# EAGLE design adc_cap (EAGLE 7.1.0)
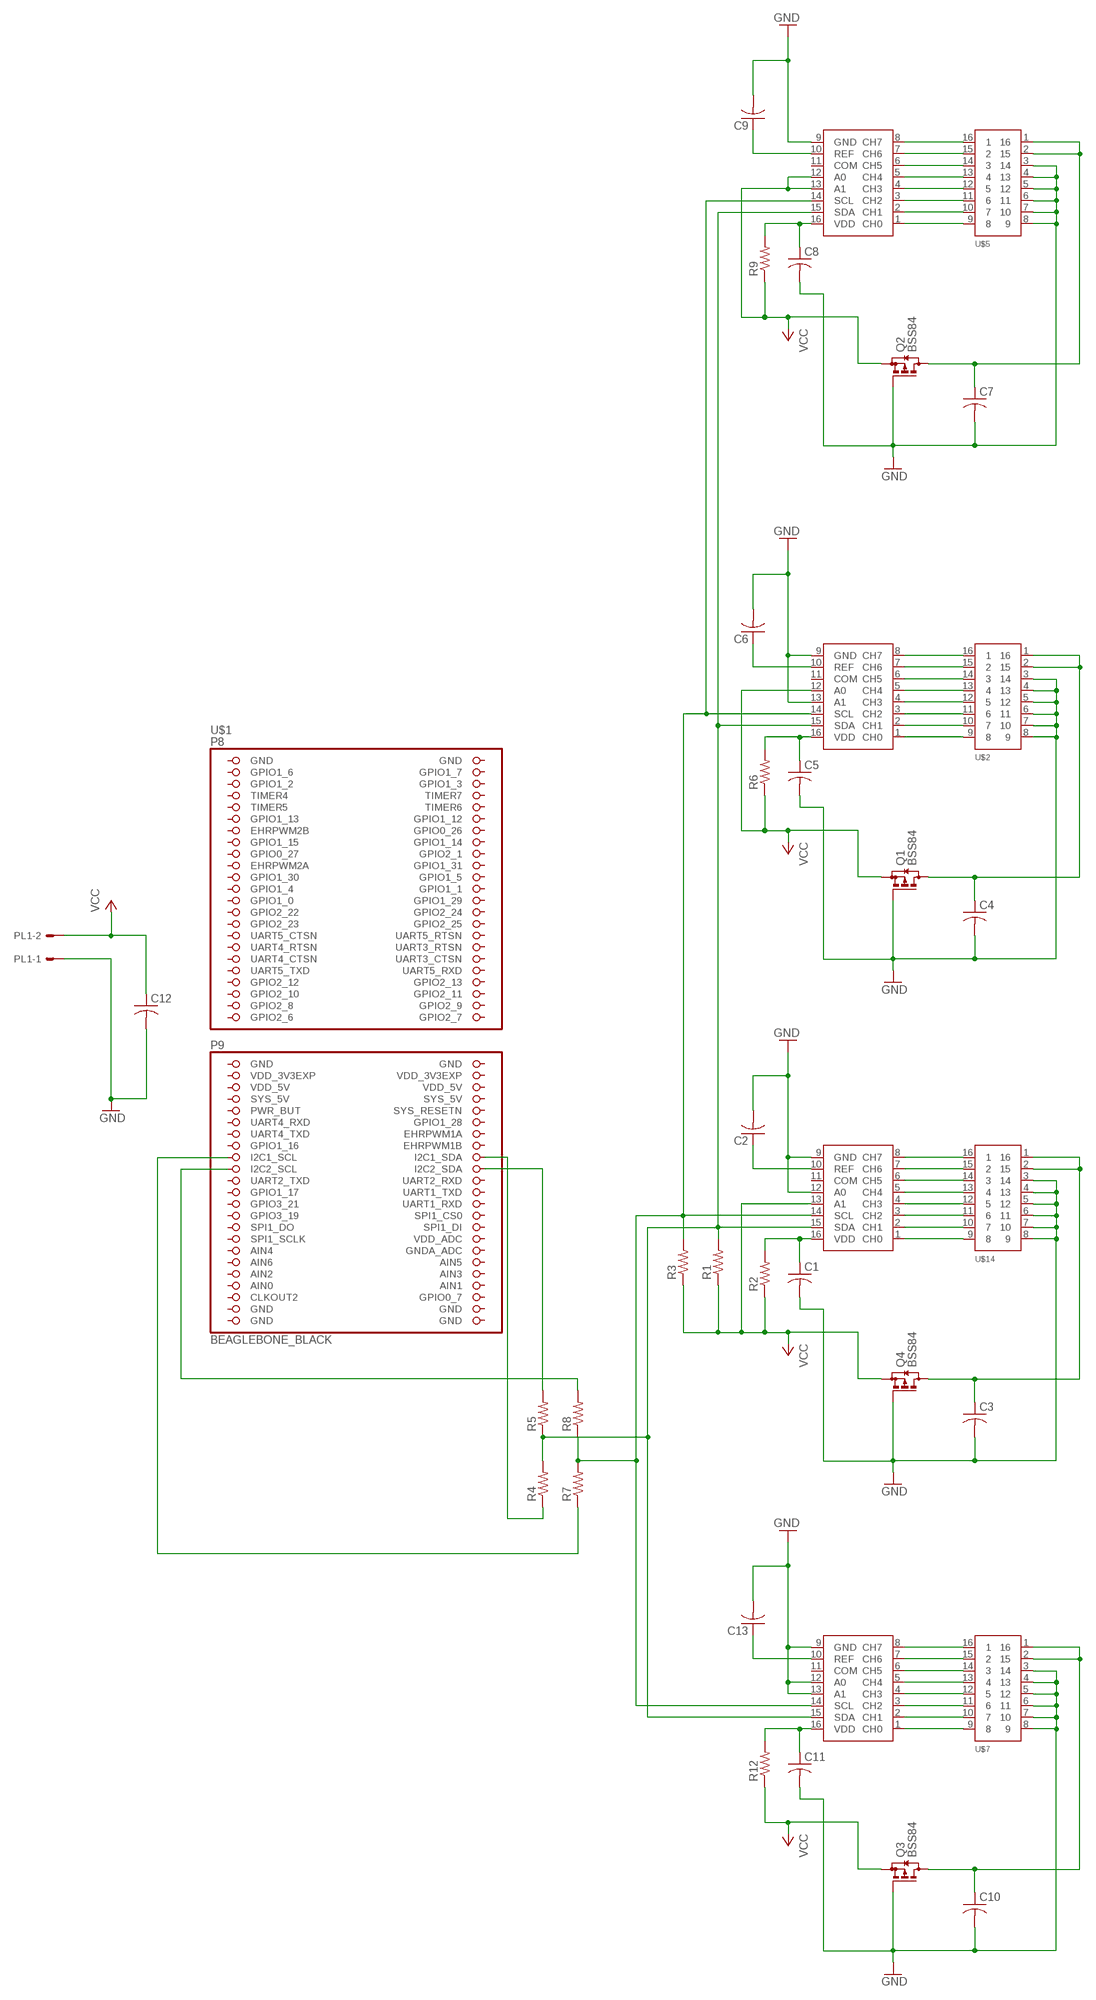
[diagram p0: schematic, sheet 1]

## Parts
C1  C-USC0805  [C0805]
C2  C-USC0805  [C0805]
C3  C-USC0805  [C0805]
C4  C-USC0805  [C0805]
C5  C-USC0805  [C0805]
C6  C-USC0805  [C0805]
C7  C-USC0805  [C0805]
C8  C-USC0805  [C0805]
C9  C-USC0805  [C0805]
C10  C-USC0805  [C0805]
C11  C-USC0805  [C0805]
C12  C-USC0805  [C0805]
C13  C-USC0805  [C0805]
PL1  555X-2H  [5569-2]
Q1  BSS84  [SOT23]
Q2  BSS84  [SOT23]
Q3  BSS84  [SOT23]
Q4  BSS84  [SOT23]
R1  R-US_R0805  [R0805]
R2  R-US_R0805  [R0805]
R3  R-US_R0805  [R0805]
R4  R-US_R0805  [R0805]
R5  R-US_R0805  [R0805]
R6  R-US_R0805  [R0805]
R7  R-US_R0805  [R0805]
R8  R-US_R0805  [R0805]
R9  R-US_R0805  [R0805]
R12  R-US_R0805  [R0805]
U$1  BEAGLEBONE_BLACK  [BEAGEBONE]
U$2  2_X_8_CON  [2_X_8_PIN]
U$3  ADS7830  [ADC8_SD]
U$4  ADS7830  [ADC8_SD]
U$5  2_X_8_CON  [2_X_8_PIN]
U$6  ADS7830  [ADC8_SD]
U$7  2_X_8_CON  [2_X_8_PIN]
U$8  ADS7830  [ADC8_SD]
U$14  2_X_8_CON  [2_X_8_PIN]

## Nets
GND: C1.2 C2.2 C3.2 C4.2 C5.2 C6.2 C7.2 C8.2 C9.2 C10.2 C11.2 C12.2 C13.2 PL1.1 Q1.1(G) Q2.1(G) Q3.1(G) Q4.1(G) U$2.3 U$2.4 U$2.5 U$2.6 U$2.7 U$2.8 U$3.9(GND) U$3.12(A0) U$4.9(GND) U$4.13(A1) U$5.3 U$5.4 U$5.5 U$5.6 U$5.7 U$5.8 U$6.9(GND) U$7.3 U$7.4 U$7.5 U$7.6 U$7.7 U$7.8 U$8.9(GND) U$8.12(A0) U$8.13(A1) U$14.3 U$14.4 U$14.5 U$14.6 U$14.7 U$14.8
N$1: U$3.1(CH0) U$14.9
N$2: R1.2 R4.2 R5.1 U$3.15(SDA) U$4.15(SDA) U$6.15(SDA) U$8.15(SDA)
N$3: U$3.2(CH1) U$14.10
N$4: U$3.3(CH2) U$14.11
N$5: U$3.4(CH3) U$14.12
N$6: U$3.5(CH4) U$14.13
N$7: U$3.6(CH5) U$14.14
N$8: U$3.7(CH6) U$14.15
N$9: U$3.8(CH7) U$14.16
N$10: R5.2 U$1.167(I2C2_SDA)
N$11: C1.1 R2.2 U$3.16(VDD)
N$12: C2.1 U$3.10(REF)
N$13: R3.2 R7.2 R8.1 U$3.14(SCL) U$4.14(SCL) U$6.14(SCL) U$8.14(SCL)
N$14: C4.1 Q1.3(D) U$2.1 U$2.2
N$15: U$2.9 U$4.1(CH0)
N$16: U$2.10 U$4.2(CH1)
N$17: U$2.11 U$4.3(CH2)
N$18: U$2.12 U$4.4(CH3)
N$19: U$2.13 U$4.5(CH4)
N$20: U$2.14 U$4.6(CH5)
N$21: U$2.15 U$4.7(CH6)
N$22: U$2.16 U$4.8(CH7)
N$23: R4.1 U$1.165(I2C1_SDA)
N$24: R8.2 U$1.166(I2C2_SCL)
N$25: C5.1 R6.2 U$4.16(VDD)
N$26: C6.1 U$4.10(REF)
N$27: C7.1 Q2.3(D) U$5.1 U$5.2
N$28: U$5.9 U$6.1(CH0)
N$29: U$5.10 U$6.2(CH1)
N$30: U$5.11 U$6.3(CH2)
N$31: U$5.12 U$6.4(CH3)
N$32: U$5.13 U$6.5(CH4)
N$33: U$5.14 U$6.6(CH5)
N$34: U$5.15 U$6.7(CH6)
N$35: U$5.16 U$6.8(CH7)
N$36: R7.1 U$1.168(I2C1_SCL)
N$38: C8.1 R9.2 U$6.16(VDD)
N$39: C9.1 U$6.10(REF)
N$40: C10.1 Q3.3(D) U$7.1 U$7.2
N$41: U$7.9 U$8.1(CH0)
N$42: U$7.10 U$8.2(CH1)
N$43: U$7.11 U$8.3(CH2)
N$44: U$7.12 U$8.4(CH3)
N$45: U$7.13 U$8.5(CH4)
N$46: U$7.14 U$8.6(CH5)
N$47: U$7.15 U$8.7(CH6)
N$48: U$7.16 U$8.8(CH7)
N$51: C11.1 R12.2 U$8.16(VDD)
N$52: C13.1 U$8.10(REF)
N$76: C3.1 Q4.3(D) U$14.1 U$14.2
VCC: C12.1 PL1.2 Q1.2(S) Q2.2(S) Q3.2(S) Q4.2(S) R1.1 R2.1 R3.1 R6.1 R9.1 R12.1 U$3.13(A1) U$4.12(A0) U$6.12(A0) U$6.13(A1)
Unconnected: U$1.93(GPIO2_7) U$1.94(GPIO2_6) U$1.95(GPIO2_9) U$1.96(GPIO2_8) U$1.97(GPIO2_11) U$1.98(GPIO2_10) U$1.99(GPIO2_13) U$1.100(GPIO2_12) U$1.101(UART5_RXD) U$1.102(UART5_TXD) U$1.103(UART3_CTSN) U$1.104(UART4_CTSN) U$1.105(UART3_RTSN) U$1.106(UART4_RTSN) U$1.107(UART5_RTSN) U$1.108(UART5_CTSN) U$1.109(GPIO2_25) U$1.110(GPIO2_23) U$1.111(GPIO2_24) U$1.112(GPIO2_22) U$1.113(GPIO1_29) U$1.114(GPIO1_0) U$1.115(GPIO1_1) U$1.116(GPIO1_4) U$1.117(GPIO1_5) U$1.118(GPIO1_30) U$1.119(GPIO1_31) U$1.120(EHRPWM2A) U$1.121(GPIO2_1) U$1.122(GPIO0_27) U$1.123(GPIO1_14) U$1.124(GPIO1_15) U$1.125(GPIO0_26) U$1.126(EHRPWM2B) U$1.127(GPIO1_12) U$1.128(GPIO1_13) U$1.129(TIMER6) U$1.130(TIMER5) U$1.131(TIMER7) U$1.132(TIMER4) U$1.133(GPIO1_3) U$1.134(GPIO1_2) U$1.135(GPIO1_7) U$1.136(GPIO1_6) U$1.143(GPIO0_7) U$1.144(CLKOUT2) U$1.145(AIN1) U$1.147(AIN3) U$1.148(AIN2) U$1.149(AIN5) U$1.150(AIN6) U$1.151(GNDA_ADC) U$1.152(AIN4) U$1.153(VDD_ADC) U$1.154(SPI1_SCLK) U$1.155(SPI1_DI) U$1.156(SPI1_DO) U$1.157(SPI1_CS0) U$1.158(GPIO3_19) U$1.159(UART1_RXD) U$1.160(GPIO3_21) U$1.161(UART1_TXD) U$1.162(GPIO1_17) U$1.163(UART2_RXD) U$1.164(UART2_TXD) U$1.169(EHRPWM1B) U$1.170(GPIO1_16) U$1.171(EHRPWM1A) U$1.172(UART4_TXD) U$1.173(GPIO1_28) U$1.174(UART4_RXD) U$1.175(SYS_RESETN) U$1.176(PWR_BUT) U$1.177(SYS_5V) U$3.11(COM) U$4.11(COM) U$6.11(COM) U$8.11(COM)

## Power pins joined to a net without a drawn wire
AIN0: U$1.146(AIN0)
GND: U$1.137(GND) U$1.138(GND) U$1.139(GND) U$1.140(GND) U$1.141(GND) U$1.142(GND) U$1.183(GND) U$1.184(GND)
SYS_5V: U$1.178(SYS_5V)
VDD_3V3EXP: U$1.181(VDD_3V3EXP) U$1.182(VDD_3V3EXP)
VDD_5V: U$1.179(VDD_5V) U$1.180(VDD_5V)

## Library data of the parts
C1-C13 = rcl:C-US: CAPACITOR, American symbol
PL1 = con-molex-2:555X-2: Mini FIT connector 2 way
Q1-Q4 = transistor-small-signal:BSS84: P-CHANNEL MOS FET
R1-R9 R12 = adafruit:R-US_: RESISTOR, American symbol
U$1 = BeagleBone:BEAGLEBONE_BLACK
U$2 U$5 U$7 U$14 = 11_pin_connecterp:2_X_8_CON
U$3 U$4 U$6 U$8 = ADC128D818:ADS7830

## Net classes
0 default: width 0.203 mm, drill 0.381 mm, clearance 0.254 mm

## Board
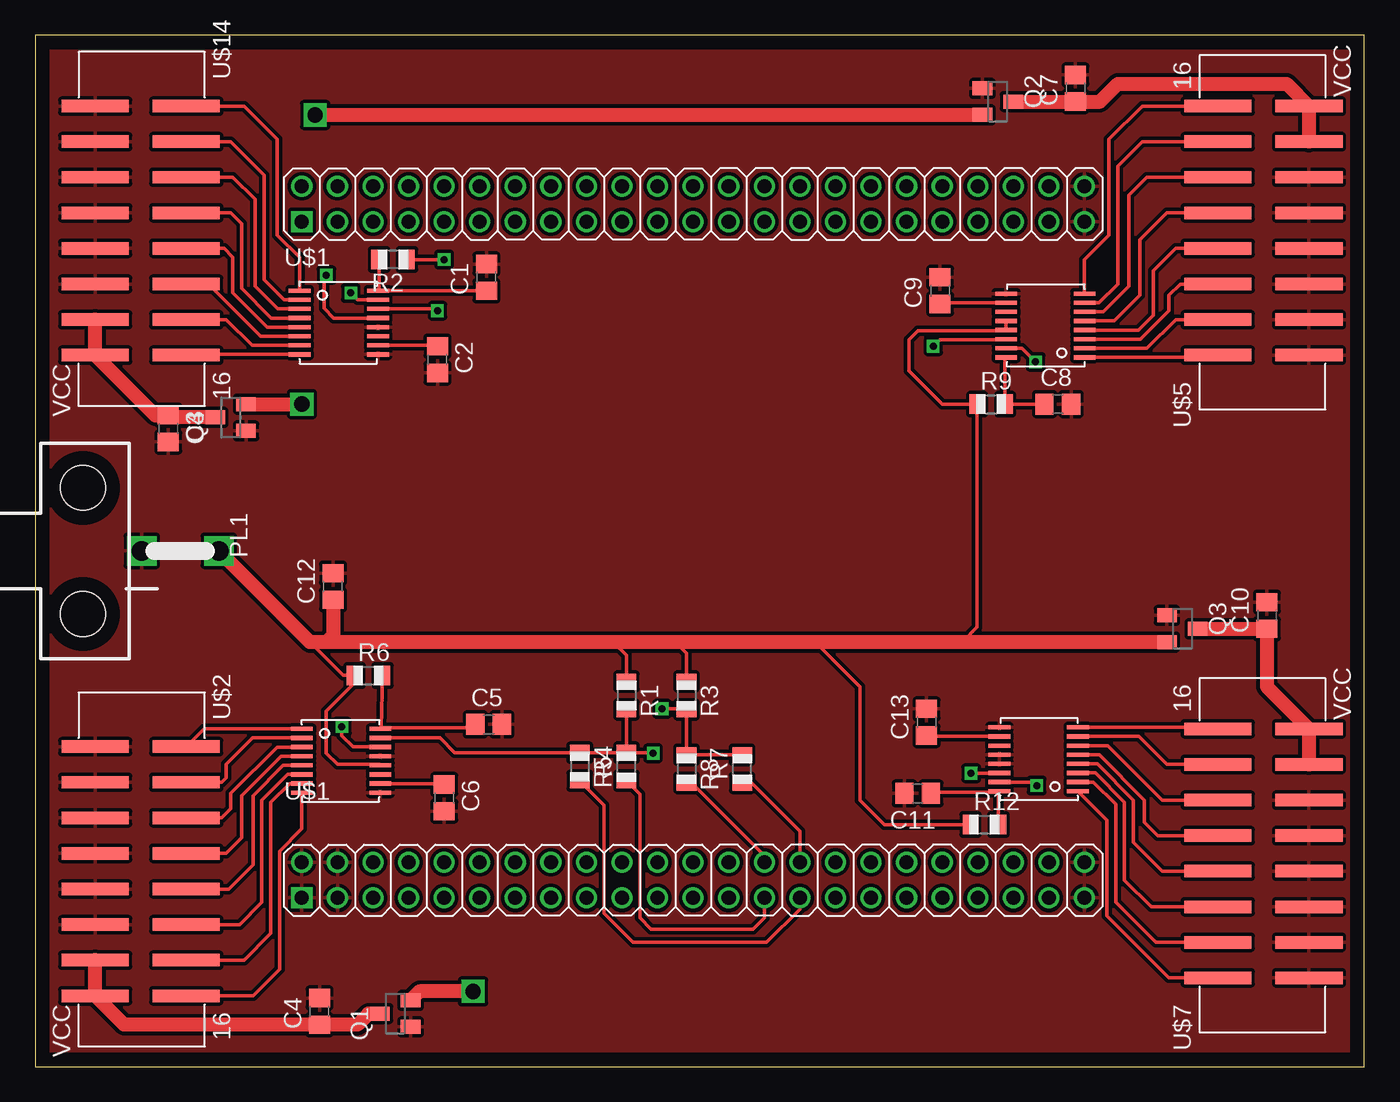
[diagram p1: board, top side]
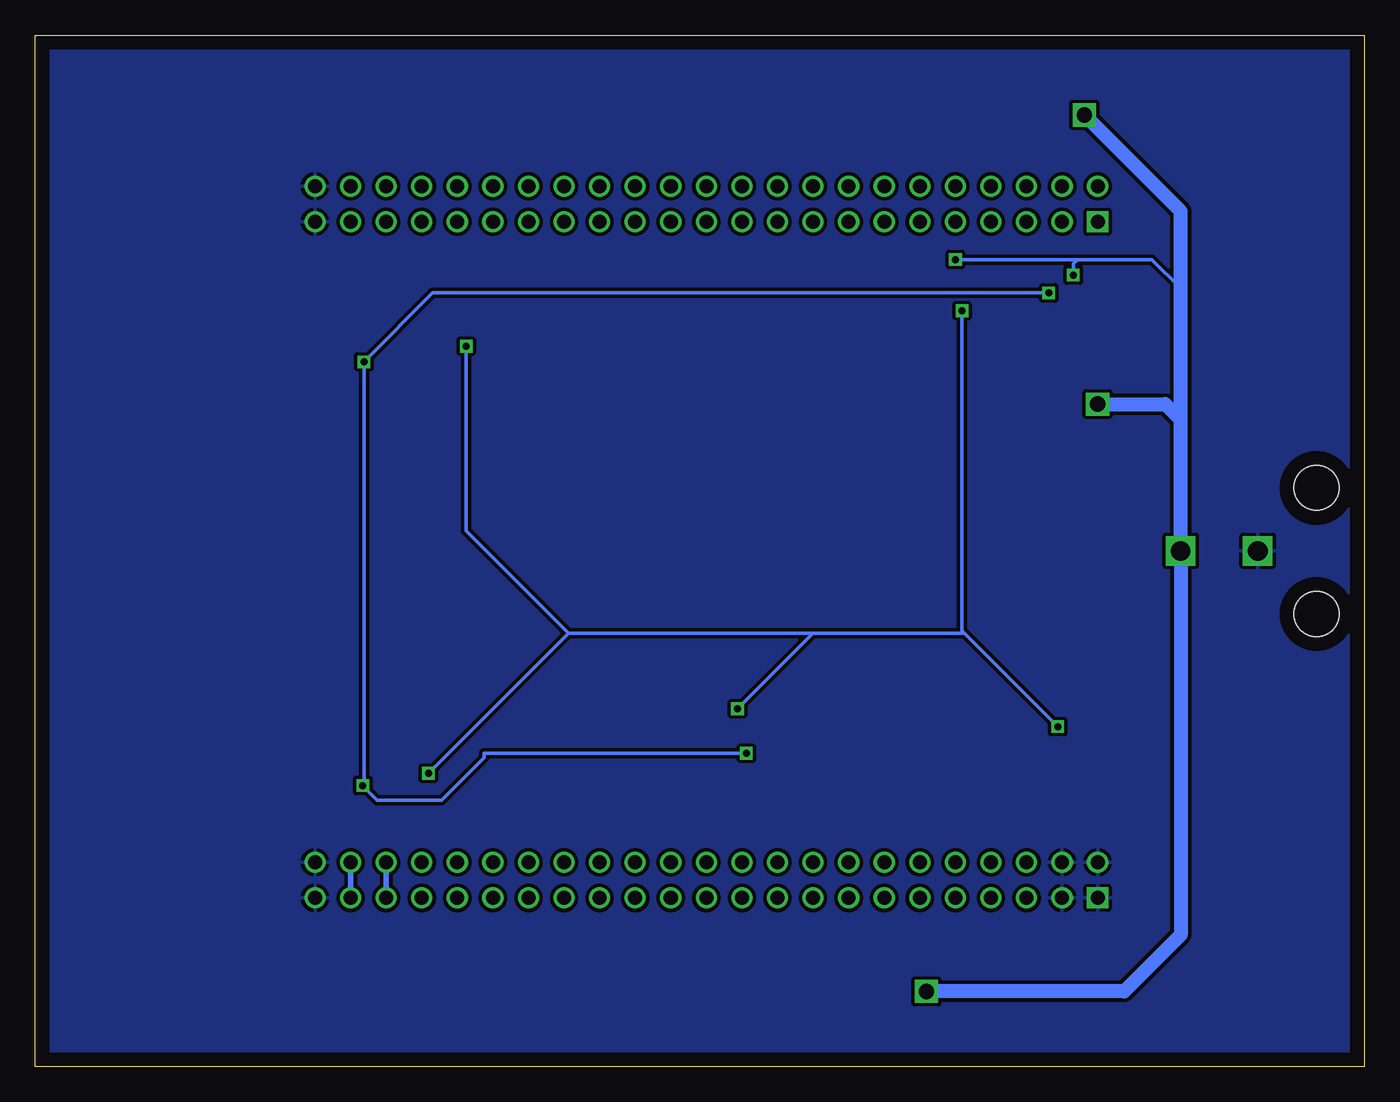
[diagram p2: board, bottom side, seen from below]

Size 94.92 x 73.65 mm. Coordinates in mm from the lower left corner, seen from the top.
Outline: 0,0 94.92,0 94.92,73.65 0,73.65 0,0
Copper layers (1*16): Top 0.035mm / dielectric 1.5mm / Bottom 0.035mm
Design rules "default": minimum track width 10mil, minimum drill 24mil, track to track 8mil, track to pad 8mil, pad to pad 8mil, via to via 8mil, smd to smd 8mil, copper to edge 40mil, drill to drill 8mil, minimum pad ring 10mil, minimum via ring 8mil, stop-mask expansion 4mil, vias tented up to drill 0mil, thermal gap 10mil

### Footprints (pad centres in the part's own frame; a part is rotated, then mirrored left to right if it is on the bottom)
C0805 = smd 1.3 x 1.5: 1 -0.95,0; 2 0.95,0
5569-2 = drill 1.4 square: 1 0,0; 2 0,5.5 | hole 3.2: 4.5,-4.2; -4.5,-4.2
SOT23 = smd 1 x 1.4: 1 -0.95,-1.1; 2 0.95,-1.1; 3 0,1.1
R0805 = smd 1.1 x 1.4: 1 -1,0; 2 1,0
BEAGEBONE = drill 1 square: 93 -22.225,-33.02; 139 26.035,-33.02 | drill 1: 94 -24.765,-33.02; 95 -22.225,-30.48; 96 -24.765,-30.48; 97 -22.225,-27.94; 98 -24.765,-27.94; 99 -22.225,-25.4; 100 -24.765,-25.4; 101 -22.225,-22.86; 102 -24.765,-22.86; 103 -22.225,-20.32; 104 -24.765,-20.32; 105 -22.225,-17.78; 106 -24.765,-17.78; 107 -22.225,-15.24; 108 -24.765,-15.24; 109 -22.225,-12.7; 110 -24.765,-12.7; 111 -22.225,-10.16; 112 -24.765,-10.16; 113 -22.225,-7.62; 114 -24.765,-7.62; 115 -22.225,-5.08; 116 -24.765,-5.08; 117 -22.225,-2.54; 118 -24.765,-2.54; 119 -22.225,0; 120 -24.765,0; 121 -22.225,2.54; 122 -24.765,2.54; 123 -22.225,5.08; 124 -24.765,5.08; 125 -22.225,7.62; 126 -24.765,7.62; 127 -22.225,10.16; 128 -24.765,10.16; 129 -22.225,12.7; 130 -24.765,12.7; 131 -22.225,15.24; 132 -24.765,15.24; 133 -22.225,17.78; 134 -24.765,17.78; 135 -22.225,20.32; 136 -24.765,20.32; 137 -22.225,22.86; 138 -24.765,22.86; 140 23.495,-33.02; 141 26.035,-30.48; 142 23.495,-30.48; 143 26.035,-27.94; 144 23.495,-27.94; 145 26.035,-25.4; 146 23.495,-25.4; 147 26.035,-22.86; 148 23.495,-22.86; 149 26.035,-20.32; 150 23.495,-20.32; 151 26.035,-17.78; 152 23.495,-17.78; 153 26.035,-15.24; 154 23.495,-15.24; 155 26.035,-12.7; 156 23.495,-12.7; 157 26.035,-10.16; 158 23.495,-10.16; 159 26.035,-7.62; 160 23.495,-7.62; 161 26.035,-5.08; 162 23.495,-5.08; 163 26.035,-2.54; 164 23.495,-2.54; 165 26.035,0; 166 23.495,0; 167 26.035,2.54; 168 23.495,2.54; 169 26.035,5.08; 170 23.495,5.08; 171 26.035,7.62; 172 23.495,7.62; 173 26.035,10.16; 174 23.495,10.16; 175 26.035,12.7; 176 23.495,12.7; 177 26.035,15.24; 178 23.495,15.24; 179 26.035,17.78; 180 23.495,17.78; 181 26.035,20.32; 182 23.495,20.32; 183 26.035,22.86; 184 23.495,22.86
2_X_8_PIN = smd 0.89 x 4.8: 1 -8.89,3.325; 2 -6.35,3.325; 3 -3.81,3.325; 4 -1.27,3.325; 5 1.27,3.325; 6 3.81,3.325; 7 6.35,3.325; 8 8.89,3.325; 9 8.89,-3.175; 10 6.35,-3.175; 11 3.81,-3.175; 12 1.27,-3.175; 13 -1.27,-3.175; 14 -3.81,-3.175; 15 -6.35,-3.175; 16 -8.89,-3.175
ADC8_SD = smd 0.3 x 1.55: 1 0,0; 2 0.65,0; 3 1.3,0; 4 1.95,0; 5 2.6,0; 6 3.25,0; 7 3.9,0; 8 4.55,0; 9 4.55,5.6; 10 3.9,5.6; 11 3.25,5.6; 12 2.6,5.6; 13 1.95,5.6; 14 1.3,5.6; 15 0.65,5.6; 16 0,5.6

### Placement (x,y rotation side)
C1  32.23,56.36 90 top
C2  28.73,50.48 270 top
C3  9.53,45.56 270 top
C4  20.32,3.97 90 top
C5  32.38,24.45 0 top
C6  29.21,19.21 270 top
C7  74.3,69.85 90 top
C8  73.03,47.31 0 top
C9  64.61,55.4 90 top
C10  87.95,32.23 90 top
C11  63.02,19.53 180 top
C12  21.27,34.29 90 top
C13  63.66,24.61 90 top
PL1  7.62,36.83 270 top
Q1  25.72,3.81 90 top
Q2  68.74,68.9 270 top
Q3  81.92,31.27 270 top
Q4  13.97,46.35 90 top
R1  42.23,26.51 270 top
R2  25.56,57.63 180 top
R3  46.51,26.51 270 top
R4  42.23,21.43 90 top
R5  38.89,21.43 270 top
R6  23.81,27.94 0 top
R7  50.48,21.27 90 top
R8  46.51,21.27 270 top
R9  68.26,47.31 0 top
R12  67.79,17.3 0 top
U$1  52.07,38.1 270 top
U$2  7.62,13.97 90 top
U$3  18.89,55.4 270 top
U$4  19.05,24.13 270 top
U$5  87.63,59.69 270 top
U$6  74.93,50.64 90 top
U$7  87.63,15.24 270 top
U$8  74.45,19.68 90 top
U$14  7.62,59.69 90 top

### Tracks (layer width: path | path; a pad name or v marks a point on that pad's centre or on a via)
GND
  pour Top (isolate 0.254): -1.27,74.93 96.52,74.93 96.52,-2.54 -1.27,-2.54
  pour Bottom (isolate 0.254): -1.27,74.93 96.52,74.93 96.52,-2.54 -1.27,-2.54
N$1
  Top 0.254: U$3.1 18.89,57.78 17.3,59.37 17.3,66.2 14.92,68.58 U$14.9
N$2  (via drill 0.5)
  Top 0.254: R4.2 R5.1 29.96,22.43 28.91,23.48 U$4.15 | R1.2 R4.2 | R4.2 44.09,22.43 v44.13,22.38 | U$8.15 71.26,20.34 v71.52,20.08 | U$6.15 70.47,51.29 v71.44,50.32 | U$3.15 23.03,54.75 v22.54,55.24
  Bottom 0.254: v44.13,22.38 62.87,22.38 62.87,22.07 65.88,19.05 70.48,19.05 v71.52,20.08 71.44,20.16 v71.44,50.32 66.52,55.24 v22.54,55.24
N$3
  Top 0.254: U$3.2 17.8,54.75 16.35,56.2 16.35,63.66 13.97,66.04 U$14.10
N$4
  Top 0.254: U$3.3 17.33,54.1 15.72,55.72 15.72,61.91 14.13,63.5 U$14.11
N$5
  Top 0.254: U$3.4 16.87,53.45 14.76,55.56 14.76,60.17 13.97,60.96 U$14.12
N$6
  Top 0.254: U$3.5 16.57,52.8 14.13,55.24 14.13,57.78 13.49,58.42 U$14.13
N$7
  Top 0.254: U$3.6 16.11,52.15 12.38,55.88 U$14.14
N$8
  Top 0.254: U$3.7 15.49,51.5 13.65,53.34 U$14.15
N$9
  Top 0.254: U$3.8 10.85,50.85 U$14.16
N$10
  Top 0.254: R5.2 40.64,18.68 40.64,10.95 42.7,8.89 52.23,8.89 54.61,11.27 U$1.167
N$11
  Top 0.254: R2.2 24.56,55.47 U$3.16 C1.1
N$12
  Top 0.254: U$3.10 28.66,51.5 C2.1
N$13  (via drill 0.5)
  Top 0.254: R7.2 R8.1 R3.2 46.47,25.56 v44.77,25.56 | U$4.14 24.62,22.86 22.7,22.86 21.91,23.65 v21.91,24.29 | v28.73,53.98 28.61,54.1 U$3.14 | U$8.14 68.82,20.95 v66.83,20.95 | U$6.14 69.3,51.91 64.61,51.91 v64.14,51.44
  Bottom 0.254: v21.91,24.29 28.57,30.96 | 28.57,30.96 28.73,31.11 v28.73,53.98 | v44.77,25.56 39.37,30.96 | 39.37,30.96 28.57,30.96 | v66.83,20.95 56.83,30.96 | 56.83,30.96 39.37,30.96 | 56.83,30.96 64.14,38.26 v64.14,51.44
N$14
  Top 1.016: Q1.3 23.81,3.81 23.02,3.02 C4.1 6.36,3.02 U$2.1 U$2.2
N$15
  Top 0.254: U$4.1 12.06,24.13 U$2.9
N$16
  Top 0.254: U$4.2 15.54,23.48 13.65,21.59 13.65,20.64 13.34,20.32 U$2.10
N$17
  Top 0.254: U$4.3 17.27,22.83 13.97,19.53 13.97,18.41 13.34,17.78 U$2.11
N$18
  Top 0.254: U$4.4 17.58,22.18 14.76,19.37 14.76,16.35 13.65,15.24 U$2.12
N$19
  Top 0.254: U$4.5 17.72,21.53 15.56,19.37 15.56,14.45 13.81,12.7 U$2.13
N$20
  Top 0.254: U$4.6 18.02,20.88 16.19,19.05 16.19,11.75 14.61,10.16 U$2.14
N$21
  Top 0.254: U$4.7 18.17,20.23 16.83,18.89 16.83,9.53 14.92,7.62 U$2.15
N$22
  Top 0.254: U$4.8 19.05,16.99 17.46,15.4 17.46,6.99 15.56,5.08 U$2.16
N$23
  Top 0.254: R4.1 43.18,19.48 43.18,10.64 43.97,9.84 51.28,9.84 52.07,10.64 U$1.165
N$24
  Top 0.254: R8.2 46.88,20.27 52.07,15.08 U$1.166
N$25
  Top 0.254: R6.2 24.72,24.2 | 24.72,24.2 U$4.16 | 24.72,24.2 31.18,24.2 C5.1
N$26
  Top 0.254: U$4.10 29.14,20.23 C6.1
N$27
  Top 1.016: Q2.3 C7.1 76.04,68.9 77.31,70.17 89.37,70.17 U$5.1 U$5.2
N$28
  Top 0.254: U$6.1 84.3,50.64 U$5.9
N$29
  Top 0.254: U$6.2 79.39,51.29 81.44,53.34 U$5.10
N$30
  Top 0.254: U$6.3 78.93,51.94 80.96,53.98 80.96,55.09 81.76,55.88 U$5.11
N$31
  Top 0.254: U$6.4 78.78,52.59 79.85,53.66 79.85,56.83 81.44,58.42 U$5.12
N$32
  Top 0.254: U$6.5 77.05,53.24 78.9,55.09 78.9,59.05 80.8,60.96 U$5.13
N$33
  Top 0.254: U$6.6 76.28,53.89 78.11,55.72 78.11,62.23 79.38,63.5 U$5.14
N$34
  Top 0.254: U$6.7 75.97,54.54 77.31,55.88 77.31,64.29 79.06,66.04 U$5.15
N$35
  Top 0.254: U$6.8 74.93,57.63 76.68,59.37 76.68,66.2 79.06,68.58 U$5.16
N$36
  Top 0.254: R7.1 51.16,20.27 54.61,16.83 U$1.168
N$38
  Top 0.254: U$6.16 69.26,50.57 R9.2 C8.1
N$39
  Top 0.254: U$6.10 64.7,54.54 C9.1
N$40
  Top 1.016: Q3.3 C10.1 87.95,27.14 U$7.1 U$7.2
N$41
  Top 0.254: U$7.9 80.96,6.35 76.52,10.79 76.52,17.62 U$8.1
N$42
  Top 0.254: U$8.2 75.55,20.34 77.15,18.73 77.15,11.75 80.01,8.89 U$7.10
N$43
  Top 0.254: U$8.3 75.69,20.98 77.79,18.89 77.79,13.34 79.69,11.43 U$7.11
N$44
  Top 0.254: U$8.4 75.84,21.64 78.42,19.05 78.42,16.03 80.49,13.97 U$7.12
N$45
  Top 0.254: U$8.5 75.98,22.29 79.22,19.05 79.22,17.46 80.17,16.51 U$7.13
N$46
  Top 0.254: U$8.6 76.6,22.93 80.49,19.05 U$7.14
N$47
  Top 0.254: U$8.7 78.81,23.59 80.8,21.59 U$7.15
N$48
  Top 0.254: U$8.8 84.35,24.23 U$7.16
N$51
  Top 0.254: R12.2 68.79,19.62 | 68.79,19.62 U$8.16 | 68.79,19.62 64.06,19.62 C11.1
N$52
  Top 0.254: U$8.10 63.73,23.59 C13.1
N$76
  Top 1.016: Q4.3 9.68,46.35 C3.1 8.58,46.51 U$14.1 U$14.2
VCC  (via drill 0.5, 1.1)
  Top 0.254: 19.63,30.32 22.01,27.94 R6.1 22.81,27.42 20.8,25.4 20.8,22.38 21.59,21.59 24.59,21.59 U$4.12 | R12.1 60.64,17.3 58.9,19.05 58.9,27.15 55.72,30.32 | R2.1 v29.21,57.63 | U$3.13 21.32,53.45 20.64,54.13 20.64,56.36 v20.8,56.52 | R1.1 42.23,29.37 41.27,30.32 | R3.1 46.51,29.53 45.72,30.32 | 66.2,30.32 67.26,31.39 R9.1 64.77,47.31 62.39,49.69 62.39,51.91 63.02,52.55 69.28,52.55 U$6.13 U$6.12
  Top 1.016: v31.27,5.4 27.45,5.4 Q1.2 | v20,67.94 Q2.2 | Q4.2 v19.05,47.3 v19.05,47.31 | Q3.2 66.2,30.32 55.72,30.32 45.72,30.32 41.27,30.32 20.8,30.32 | 20.8,30.32 19.63,30.32 PL1.2 | C12.1 21.27,30.8 20.8,30.32
  Bottom 0.254: v29.21,57.63 20.48,57.63 | 20.48,57.63 15.18,57.63 13.12,55.56 | v20.8,56.52 20.8,57.31 20.48,57.63
  Bottom 1.016: v31.27,5.4 17.14,5.4 13.12,9.42 PL1.2 13.12,46.2 | 13.12,46.2 13.12,55.56 13.12,61.06 v20,67.94 | v19.05,47.31 14.23,47.31 13.12,46.2
VDD_3V3EXP
  Bottom 0.406: U$1.182 U$1.181
VDD_5V
  Bottom 0.406: U$1.180 U$1.179